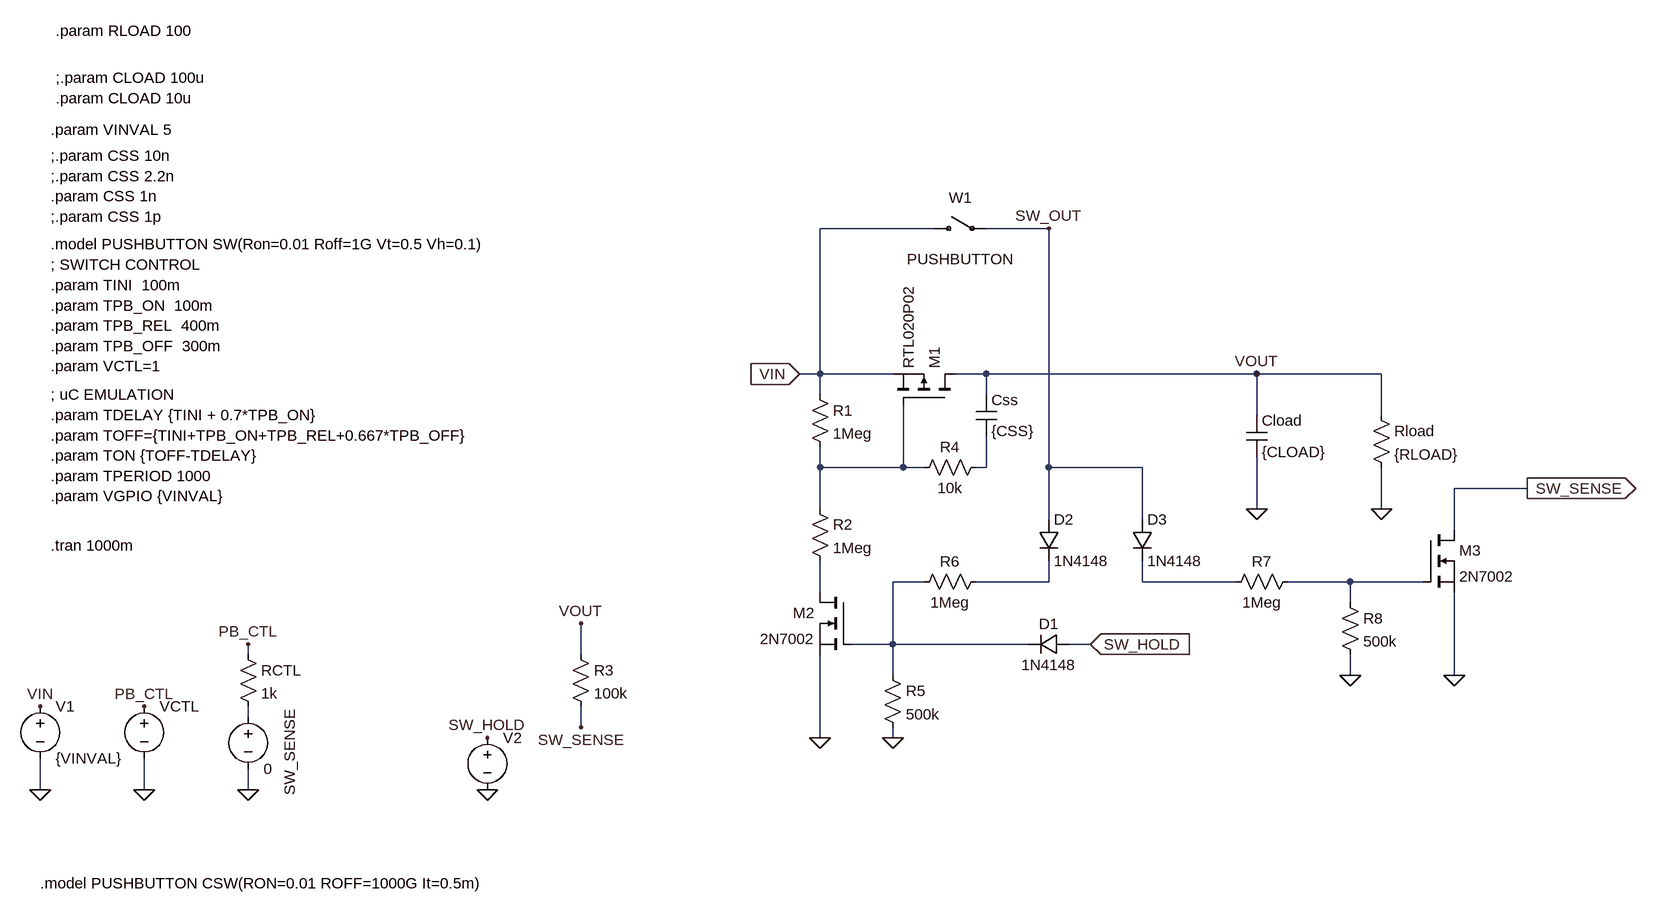
[diagram p0: schematic DI3-FETS.asc]
DI3-FETS.asc, the LTspice schematic file:
Version 4.1
SHEET 1 1196 680
WIRE 96 -576 -80 -576
WIRE 272 -576 176 -576
WIRE -80 -352 -80 -576
WIRE -80 -352 -112 -352
WIRE 32 -352 -80 -352
WIRE 176 -352 128 -352
WIRE 592 -352 176 -352
WIRE 784 -352 592 -352
WIRE -80 -320 -80 -352
WIRE 176 -320 176 -352
WIRE 592 -288 592 -352
WIRE 784 -288 784 -352
WIRE -80 -208 -80 -240
WIRE 48 -208 48 -304
WIRE 48 -208 -80 -208
WIRE 80 -208 48 -208
WIRE 176 -208 176 -256
WIRE 176 -208 160 -208
WIRE 272 -208 272 -576
WIRE 416 -208 272 -208
WIRE 1008 -176 896 -176
WIRE -80 -144 -80 -208
WIRE 592 -144 592 -224
WIRE 784 -144 784 -208
WIRE 272 -128 272 -208
WIRE 416 -128 416 -208
WIRE 896 -112 896 -176
WIRE 80 -32 32 -32
WIRE 272 -32 272 -64
WIRE 272 -32 160 -32
WIRE 416 -32 416 -64
WIRE 560 -32 416 -32
WIRE 736 -32 640 -32
WIRE 848 -32 736 -32
WIRE -80 -16 -80 -64
WIRE 736 0 736 -32
WIRE 32 64 32 -32
WIRE 32 64 -32 64
WIRE 240 64 32 64
WIRE 336 64 304 64
WIRE -960 80 -960 64
WIRE -448 80 -448 32
WIRE 32 112 32 64
WIRE 736 112 736 80
WIRE 896 112 896 -16
WIRE -960 176 -960 160
WIRE -448 192 -448 160
WIRE -80 208 -80 80
WIRE 32 208 32 192
WIRE -1280 288 -1280 240
WIRE -1120 288 -1120 240
WIRE -960 288 -960 256
FLAG -1280 288 0
FLAG -80 208 0
FLAG -592 288 0
FLAG 592 -144 0
FLAG 784 -144 0
FLAG 32 208 0
FLAG -1120 288 0
FLAG -1120 160 PB_CTL
FLAG 336 64 SW_HOLD
IOPIN 336 64 In
FLAG 592 -352 VOUT
FLAG 736 112 0
FLAG 896 112 0
FLAG 1008 -176 SW_SENSE
IOPIN 1008 -176 Out
FLAG -112 -352 VIN
IOPIN -112 -352 In
FLAG -1280 160 VIN
FLAG -960 288 0
FLAG -960 64 PB_CTL
FLAG -592 208 SW_HOLD
FLAG -448 192 SW_SENSE
FLAG -448 32 VOUT
FLAG 272 -576 SW_OUT
SYMBOL nmos -32 -16 M0
SYMATTR InstName M2
SYMATTR Value 2N7002
SYMBOL pmos 128 -304 M270
SYMATTR InstName M1
SYMATTR Value RTL020P02
SYMBOL res -96 -336 R0
SYMATTR InstName R1
SYMATTR Value 1Meg
SYMBOL res -96 -160 R0
SYMATTR InstName R2
SYMATTR Value 1Meg
SYMBOL voltage -1280 144 R0
WINDOW 123 0 0 Left 0
WINDOW 39 0 0 Left 0
SYMATTR InstName V1
SYMATTR Value {VINVAL}
SYMBOL voltage -592 192 R0
WINDOW 123 0 0 Left 0
WINDOW 39 0 0 Left 0
WINDOW 3 24 96 Invisible 2
SYMATTR Value PULSE(0 {VGPIO} {TDELAY} 1n 1n {TON} {TPERIOD})
SYMATTR InstName V2
SYMBOL cap 576 -288 R0
SYMATTR InstName Cload
SYMATTR Value {CLOAD}
SYMBOL cap 160 -320 R0
SYMATTR InstName Css
SYMATTR Value {CSS}
SYMBOL res 768 -304 R0
SYMATTR InstName Rload
SYMATTR Value {RLOAD}
SYMBOL res 176 -224 R90
WINDOW 0 0 56 VBottom 2
WINDOW 3 32 56 VTop 2
SYMATTR InstName R4
SYMATTR Value 10k
SYMBOL res 16 96 R0
SYMATTR InstName R5
SYMATTR Value 500k
SYMBOL diode 304 48 R90
WINDOW 0 0 32 VBottom 2
WINDOW 3 32 32 VTop 2
SYMATTR InstName D1
SYMATTR Value 1N4148
SYMBOL diode 256 -128 R0
SYMATTR InstName D2
SYMATTR Value 1N4148
SYMBOL res 176 -48 R90
WINDOW 0 0 56 VBottom 2
WINDOW 3 32 56 VTop 2
SYMATTR InstName R6
SYMATTR Value 1Meg
SYMBOL diode 400 -128 R0
SYMATTR InstName D3
SYMATTR Value 1N4148
SYMBOL res 656 -48 R90
WINDOW 0 0 56 VBottom 2
WINDOW 3 32 56 VTop 2
SYMATTR InstName R7
SYMATTR Value 1Meg
SYMBOL voltage -1120 144 R0
WINDOW 123 0 0 Left 0
WINDOW 39 0 0 Left 0
WINDOW 3 24 44 Invisible 2
SYMATTR Value PWL(0 0 +{TINI} 0 +1p {VCTL} +{TPB_ON} {VCTL} +1p 0 +{TPB_REL} 0 +1p {VCTL} +{TPB_OFF} {VCTL} +1p 0)
SYMATTR InstName VCTL
SYMBOL nmos 848 -112 R0
SYMATTR InstName M3
SYMATTR Value 2N7002
SYMBOL res 720 -16 R0
SYMATTR InstName R8
SYMATTR Value 500k
SYMBOL csw 96 -576 R270
WINDOW 0 32 40 VTop 2
WINDOW 3 -32 40 VBottom 2
SYMATTR InstName W1
SYMATTR Value PUSHBUTTON
SYMATTR SpiceModel SW_SENSE
SYMBOL res -976 64 R0
SYMATTR InstName RCTL
SYMATTR Value 1k
SYMBOL voltage -960 160 R0
WINDOW 123 0 0 Left 0
WINDOW 39 0 0 Left 0
WINDOW 0 64 137 VLeft 2
SYMATTR InstName SW_SENSE
SYMATTR Value 0
SYMBOL res -464 64 R0
SYMATTR InstName R3
SYMATTR Value 100k
TEXT -1264 -88 Left 2 !.tran 1000m
TEXT -1264 -552 Left 2 !.model PUSHBUTTON SW(Ron=0.01 Roff=1G Vt=0.5 Vh=0.1)
TEXT -1264 -520 Left 2 !; SWITCH CONTROL\n.param TINI  100m\n.param TPB_ON  100m\n.param TPB_REL  400m\n.param TPB_OFF  300m\n.param VCTL=1
TEXT -1264 -320 Left 2 !; uC EMULATION\n.param TDELAY {TINI + 0.7*TPB_ON}\n.param TOFF={TINI+TPB_ON+TPB_REL+0.667*TPB_OFF}\n.param TON {TOFF-TDELAY}\n.param TPERIOD 1000\n.param VGPIO {VINVAL}
TEXT -1280 432 Left 2 !.model PUSHBUTTON CSW(RON=0.01 ROFF=1000G It=0.5m)
TEXT -1264 -688 Left 2 !;.param CSS 10n\n;.param CSS 2.2n\n.param CSS 1n\n;.param CSS 1p
TEXT -1264 -728 Left 2 !.param VINVAL 5
TEXT -1256 -808 Left 2 !;.param CLOAD 100u\n.param CLOAD 10u
TEXT -1256 -880 Left 2 !.param RLOAD 100

The netlist it stands for:
* DI3-FETS.asc
M2 N007 N003 0 0 2N7002
M1 VOUT N001 VIN VIN RTL020P02
R1 VIN N001 1Meg
R2 N001 N007 1Meg
V1 VIN 0 {VINVAL}
V2 SW_HOLD 0 PULSE(0 {VGPIO} {TDELAY} 1n 1n {TON} {TPERIOD})
Cload VOUT 0 {CLOAD}
Css VOUT N002 {CSS}
Rload VOUT 0 {RLOAD}
R4 N002 N001 10k
R5 N003 0 500k
D1 SW_HOLD N003 1N4148
D2 SW_OUT N004 1N4148
R6 N004 N003 1Meg
D3 SW_OUT N005 1N4148
R7 N006 N005 1Meg
VCTL PB_CTL 0 PWL(0 0 +{TINI} 0 +1p {VCTL} +{TPB_ON} {VCTL} +1p 0 +{TPB_REL} 0 +1p {VCTL} +{TPB_OFF} {VCTL} +1p 0)
M3 SW_SENSE N006 0 0 2N7002
R8 N006 0 500k
W1 VIN SW_OUT SW_SENSE PUSHBUTTON
RCTL PB_CTL N008 1k
V§SW_SENSE N008 0 0
R3 VOUT SW_SENSE 100k
.model D D
.lib standard.dio
.model NMOS NMOS
.model PMOS PMOS
.lib standard.mos
.tran 1000m
.model PUSHBUTTON SW(Ron=0.01 Roff=1G Vt=0.5 Vh=0.1)
; SWITCH CONTROL
.param TINI  100m
.param TPB_ON  100m
.param TPB_REL  400m
.param TPB_OFF  300m
.param VCTL=1
; uC EMULATION
.param TDELAY {TINI + 0.7*TPB_ON}
.param TOFF={TINI+TPB_ON+TPB_REL+0.667*TPB_OFF}
.param TON {TOFF-TDELAY}
.param TPERIOD 1000
.param VGPIO {VINVAL}
.model PUSHBUTTON CSW(RON=0.01 ROFF=1000G It=0.5m)
;.param CSS 10n
;.param CSS 2.2n
.param CSS 1n
;.param CSS 1p
.param VINVAL 5
;.param CLOAD 100u
.param CLOAD 10u
.param RLOAD 100
.backanno
.end